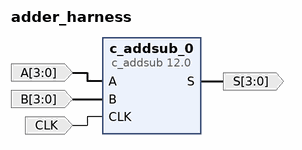
[diagram p0: block diagram of the top level]
# Vivado block design adder_harness, Vivado 2014.2
create_bd_design adder_harness

create_bd_port -dir I -from 3 -to 0 -type data A
create_bd_port -dir I -from 3 -to 0 -type data B
create_bd_port -dir I -type clk CLK
create_bd_port -dir O -from 3 -to 0 -type data S

create_bd_cell -type ip -vlnv xilinx.com:ip:c_addsub:12.0 c_addsub_0
set_property -dict [list \
  CONFIG.A_Type Unsigned \
  CONFIG.B_Type Unsigned \
  CONFIG.A_Width 4 \
  CONFIG.B_Width 4 \
  CONFIG.CE false \
] [get_bd_cells c_addsub_0]

# ---- connections ----

connect_bd_net [get_bd_ports A] [get_bd_pins c_addsub_0/A]
connect_bd_net [get_bd_ports B] [get_bd_pins c_addsub_0/B]
connect_bd_net [get_bd_ports CLK] [get_bd_pins c_addsub_0/CLK]
connect_bd_net [get_bd_pins c_addsub_0/S] [get_bd_ports S]

validate_bd_design
save_bd_design
